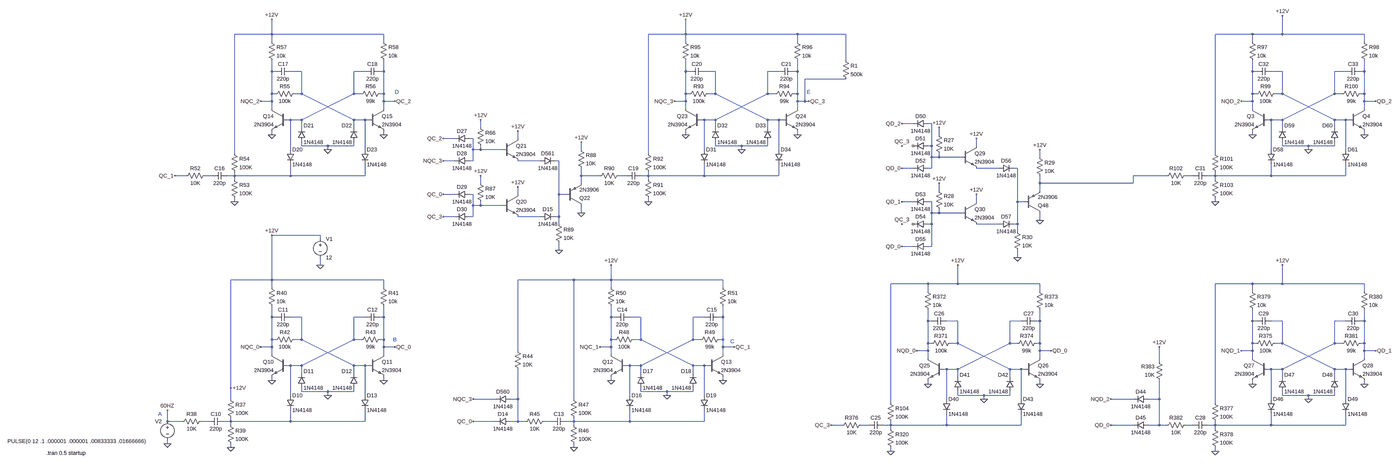
[diagram p0: schematic clock-scaler.asc, whole sheet]
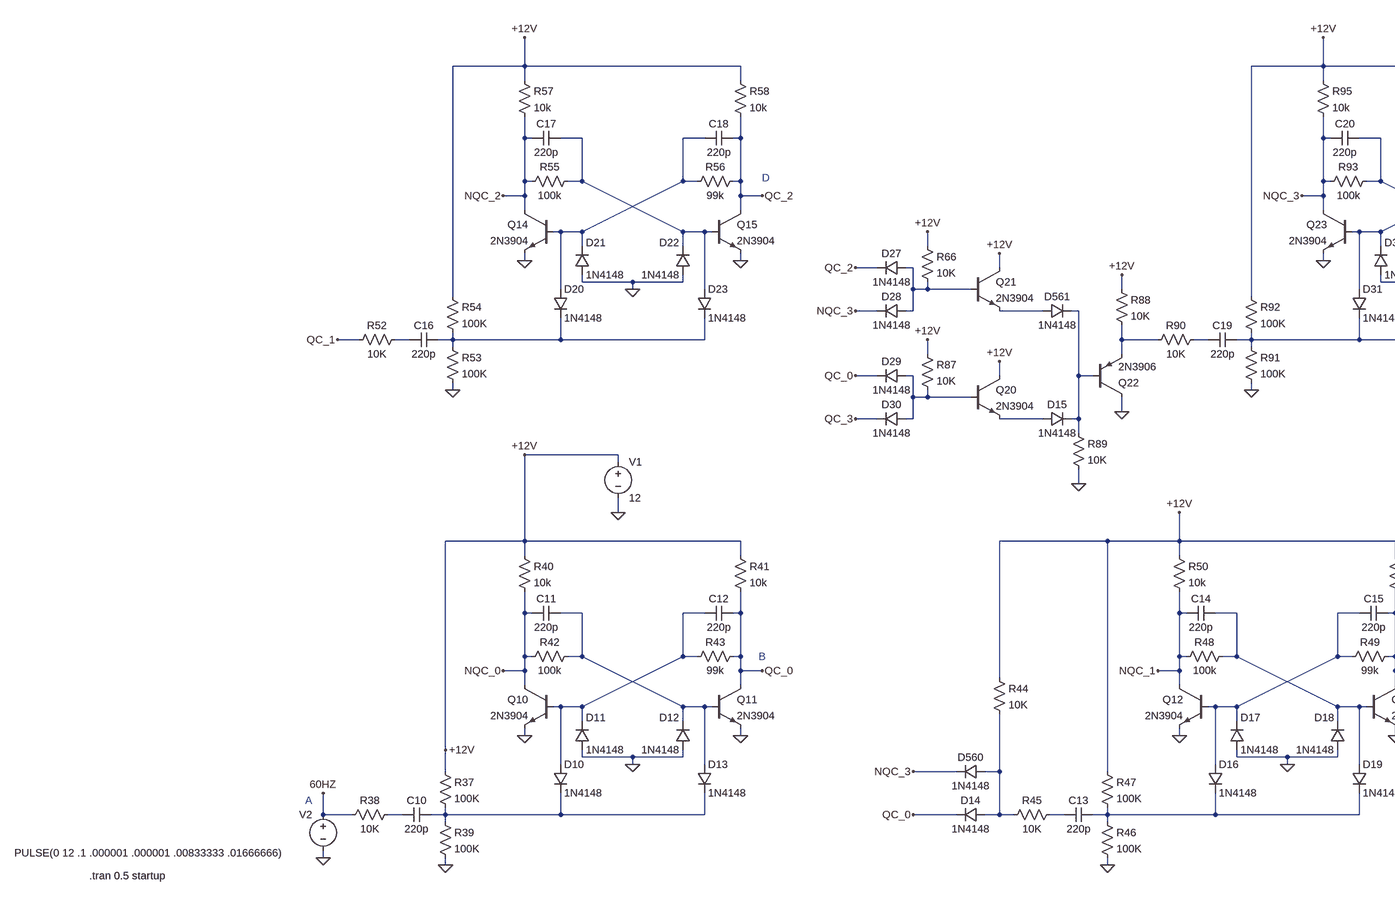
[diagram p1: schematic clock-scaler.asc, part, row 1 of 1, column 1 of 2]
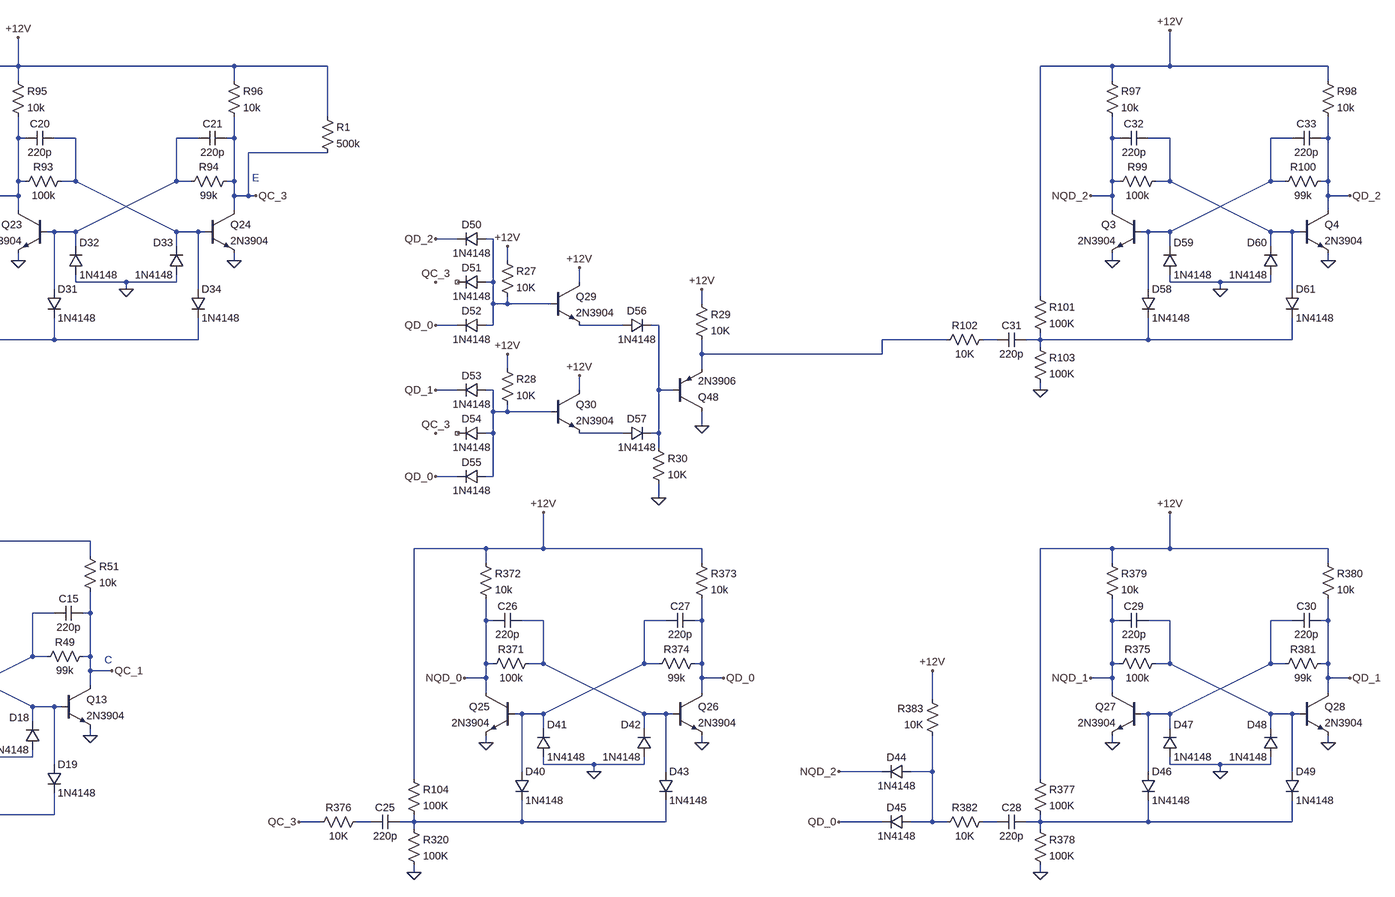
[diagram p2: schematic clock-scaler.asc, part, row 1 of 1, column 2 of 2]
clock-scaler.asc, the LTspice schematic file:
Version 4
SHEET 1 5132 680
WIRE 112 -1232 112 -1296
WIRE 112 -1232 -48 -1232
WIRE 592 -1232 112 -1232
WIRE 1888 -1232 1888 -1296
WIRE 1888 -1232 1728 -1232
WIRE 2368 -1232 1888 -1232
WIRE 2576 -1232 2368 -1232
WIRE 4416 -1232 4256 -1232
WIRE 4544 -1232 4544 -1312
WIRE 4544 -1232 4416 -1232
WIRE 4896 -1232 4544 -1232
WIRE 112 -1200 112 -1232
WIRE 592 -1200 592 -1232
WIRE 1888 -1200 1888 -1232
WIRE 2368 -1200 2368 -1232
WIRE 4416 -1200 4416 -1232
WIRE 4896 -1200 4896 -1232
WIRE 2576 -1120 2576 -1232
WIRE 112 -1072 112 -1120
WIRE 128 -1072 112 -1072
WIRE 240 -1072 192 -1072
WIRE 512 -1072 464 -1072
WIRE 592 -1072 592 -1120
WIRE 592 -1072 576 -1072
WIRE 1888 -1072 1888 -1120
WIRE 1904 -1072 1888 -1072
WIRE 2016 -1072 1968 -1072
WIRE 2288 -1072 2240 -1072
WIRE 2368 -1072 2368 -1120
WIRE 2368 -1072 2352 -1072
WIRE 4416 -1072 4416 -1120
WIRE 4432 -1072 4416 -1072
WIRE 4544 -1072 4496 -1072
WIRE 4816 -1072 4768 -1072
WIRE 4896 -1072 4896 -1120
WIRE 4896 -1072 4880 -1072
WIRE 2576 -1040 2400 -1040
WIRE 112 -976 112 -1072
WIRE 128 -976 112 -976
WIRE 240 -976 240 -1072
WIRE 240 -976 208 -976
WIRE 464 -976 464 -1072
WIRE 496 -976 464 -976
WIRE 592 -976 592 -1072
WIRE 592 -976 576 -976
WIRE 1888 -976 1888 -1072
WIRE 1904 -976 1888 -976
WIRE 2016 -976 2016 -1072
WIRE 2016 -976 1984 -976
WIRE 2240 -976 2240 -1072
WIRE 2272 -976 2240 -976
WIRE 2368 -976 2368 -1072
WIRE 2368 -976 2352 -976
WIRE 4416 -976 4416 -1072
WIRE 4432 -976 4416 -976
WIRE 4544 -976 4544 -1072
WIRE 4544 -976 4512 -976
WIRE 4768 -976 4768 -1072
WIRE 4800 -976 4768 -976
WIRE 4896 -976 4896 -1072
WIRE 4896 -976 4880 -976
WIRE 112 -944 112 -976
WIRE 112 -944 64 -944
WIRE 592 -944 592 -976
WIRE 640 -944 592 -944
WIRE 1888 -944 1888 -976
WIRE 1888 -944 1840 -944
WIRE 2368 -944 2368 -976
WIRE 2400 -944 2400 -1040
WIRE 2400 -944 2368 -944
WIRE 2416 -944 2400 -944
WIRE 4416 -944 4416 -976
WIRE 4416 -944 4368 -944
WIRE 4896 -944 4896 -976
WIRE 4944 -944 4896 -944
WIRE 112 -912 112 -944
WIRE 592 -912 592 -944
WIRE 1888 -912 1888 -944
WIRE 2368 -912 2368 -944
WIRE 4416 -912 4416 -944
WIRE 4896 -912 4896 -944
WIRE 192 -864 176 -864
WIRE 240 -864 464 -976
WIRE 240 -864 192 -864
WIRE 464 -864 240 -976
WIRE 512 -864 464 -864
WIRE 528 -864 512 -864
WIRE 1968 -864 1952 -864
WIRE 2016 -864 2240 -976
WIRE 2016 -864 1968 -864
WIRE 2240 -864 2016 -976
WIRE 2288 -864 2240 -864
WIRE 2304 -864 2288 -864
WIRE 4496 -864 4480 -864
WIRE 4544 -864 4768 -976
WIRE 4544 -864 4496 -864
WIRE 4768 -864 4544 -976
WIRE 4816 -864 4768 -864
WIRE 4832 -864 4816 -864
WIRE 2864 -848 2816 -848
WIRE 2944 -848 2928 -848
WIRE 240 -832 240 -864
WIRE 464 -832 464 -864
WIRE 1008 -832 1008 -864
WIRE 2016 -832 2016 -864
WIRE 2240 -832 2240 -864
WIRE 4544 -832 4544 -864
WIRE 4768 -832 4768 -864
WIRE 112 -800 112 -816
WIRE 592 -800 592 -816
WIRE 1888 -800 1888 -816
WIRE 2368 -800 2368 -816
WIRE 2976 -800 2976 -832
WIRE 4416 -800 4416 -816
WIRE 4896 -800 4896 -816
WIRE 896 -784 848 -784
WIRE 976 -784 960 -784
WIRE 1168 -784 1168 -816
WIRE 240 -752 240 -768
WIRE 352 -752 240 -752
WIRE 464 -752 464 -768
WIRE 464 -752 352 -752
WIRE 2016 -752 2016 -768
WIRE 2128 -752 2016 -752
WIRE 2240 -752 2240 -768
WIRE 2240 -752 2128 -752
WIRE 2944 -752 2944 -848
WIRE 2944 -752 2928 -752
WIRE 3136 -752 3136 -784
WIRE 4544 -752 4544 -768
WIRE 4656 -752 4544 -752
WIRE 4768 -752 4768 -768
WIRE 4768 -752 4656 -752
WIRE 192 -736 192 -864
WIRE 352 -736 352 -752
WIRE 512 -736 512 -864
WIRE 976 -736 976 -784
WIRE 1008 -736 1008 -752
WIRE 1008 -736 976 -736
WIRE 1104 -736 1008 -736
WIRE 1440 -736 1440 -768
WIRE 1968 -736 1968 -864
WIRE 2128 -736 2128 -752
WIRE 2288 -736 2288 -864
WIRE 4496 -736 4496 -864
WIRE 4656 -736 4656 -752
WIRE 4816 -736 4816 -864
WIRE -48 -720 -48 -1232
WIRE 1728 -720 1728 -1232
WIRE 4256 -720 4256 -1232
WIRE 2944 -704 2944 -752
WIRE 2976 -704 2976 -720
WIRE 2976 -704 2944 -704
WIRE 3072 -704 2976 -704
WIRE 3408 -704 3408 -736
WIRE 896 -688 848 -688
WIRE 976 -688 976 -736
WIRE 976 -688 960 -688
WIRE 1264 -688 1168 -688
WIRE 1344 -688 1328 -688
WIRE 2864 -656 2816 -656
WIRE 2944 -656 2944 -704
WIRE 2944 -656 2928 -656
WIRE 3232 -656 3136 -656
WIRE 3312 -656 3296 -656
WIRE -256 -624 -304 -624
WIRE -144 -624 -176 -624
WIRE -48 -624 -48 -640
WIRE -48 -624 -80 -624
WIRE 192 -624 192 -672
WIRE 192 -624 -48 -624
WIRE 512 -624 512 -672
WIRE 512 -624 192 -624
WIRE 1440 -624 1440 -656
WIRE 1520 -624 1440 -624
WIRE 1632 -624 1600 -624
WIRE 1728 -624 1728 -640
WIRE 1728 -624 1696 -624
WIRE 1968 -624 1968 -672
WIRE 1968 -624 1728 -624
WIRE 2288 -624 2288 -672
WIRE 2288 -624 1968 -624
WIRE 4048 -624 3904 -624
WIRE 4160 -624 4128 -624
WIRE 4256 -624 4256 -640
WIRE 4256 -624 4224 -624
WIRE 4496 -624 4496 -672
WIRE 4496 -624 4256 -624
WIRE 4816 -624 4816 -672
WIRE 4816 -624 4496 -624
WIRE -48 -608 -48 -624
WIRE 1728 -608 1728 -624
WIRE 4256 -608 4256 -624
WIRE 1008 -592 1008 -624
WIRE 1440 -592 1440 -624
WIRE 3408 -592 3408 -624
WIRE 3904 -592 3904 -624
WIRE 3904 -592 3408 -592
WIRE 2976 -560 2976 -592
WIRE 3408 -560 3408 -592
WIRE 896 -544 848 -544
WIRE 976 -544 960 -544
WIRE 1168 -544 1168 -576
WIRE 1344 -544 1344 -688
WIRE 1376 -544 1344 -544
WIRE -48 -512 -48 -528
WIRE 1728 -512 1728 -528
WIRE 2864 -512 2816 -512
WIRE 2944 -512 2928 -512
WIRE 3136 -512 3136 -544
WIRE 3312 -512 3312 -656
WIRE 3344 -512 3312 -512
WIRE 4256 -512 4256 -528
WIRE 976 -496 976 -544
WIRE 1008 -496 1008 -512
WIRE 1008 -496 976 -496
WIRE 1104 -496 1008 -496
WIRE 1440 -464 1440 -496
WIRE 2944 -464 2944 -512
WIRE 2976 -464 2976 -480
WIRE 2976 -464 2944 -464
WIRE 3072 -464 2976 -464
WIRE 896 -448 848 -448
WIRE 976 -448 976 -496
WIRE 976 -448 960 -448
WIRE 1264 -448 1168 -448
WIRE 1344 -448 1344 -544
WIRE 1344 -448 1328 -448
WIRE 3408 -432 3408 -464
WIRE 1344 -416 1344 -448
WIRE 2944 -416 2944 -464
WIRE 2944 -416 2928 -416
WIRE 3232 -416 3136 -416
WIRE 3312 -416 3312 -512
WIRE 3312 -416 3296 -416
WIRE 3312 -384 3312 -416
WIRE 320 -368 112 -368
WIRE 320 -352 320 -368
WIRE 2864 -320 2816 -320
WIRE 2944 -320 2944 -416
WIRE 2944 -320 2928 -320
WIRE 1344 -304 1344 -336
WIRE 3312 -272 3312 -304
WIRE 320 -240 320 -272
WIRE 112 -176 112 -368
WIRE 112 -176 -64 -176
WIRE 592 -176 112 -176
WIRE 1408 -176 1168 -176
WIRE 1568 -176 1568 -240
WIRE 1568 -176 1408 -176
WIRE 2048 -176 1568 -176
WIRE 2928 -160 2768 -160
WIRE 3056 -160 3056 -240
WIRE 3056 -160 2928 -160
WIRE 3408 -160 3056 -160
WIRE 4416 -160 4256 -160
WIRE 4544 -160 4544 -240
WIRE 4544 -160 4416 -160
WIRE 4896 -160 4544 -160
WIRE 112 -144 112 -176
WIRE 592 -144 592 -176
WIRE 1568 -144 1568 -176
WIRE 2048 -144 2048 -176
WIRE 2928 -128 2928 -160
WIRE 3408 -128 3408 -160
WIRE 4416 -128 4416 -160
WIRE 4896 -128 4896 -160
WIRE 112 -16 112 -64
WIRE 128 -16 112 -16
WIRE 240 -16 192 -16
WIRE 512 -16 464 -16
WIRE 592 -16 592 -64
WIRE 592 -16 576 -16
WIRE 1568 -16 1568 -64
WIRE 1584 -16 1568 -16
WIRE 1696 -16 1648 -16
WIRE 1968 -16 1920 -16
WIRE 2048 -16 2048 -64
WIRE 2048 -16 2032 -16
WIRE 2928 0 2928 -48
WIRE 2944 0 2928 0
WIRE 3056 0 3008 0
WIRE 3328 0 3280 0
WIRE 3408 0 3408 -48
WIRE 3408 0 3392 0
WIRE 4416 0 4416 -48
WIRE 4432 0 4416 0
WIRE 4544 0 4496 0
WIRE 4816 0 4768 0
WIRE 4896 0 4896 -48
WIRE 4896 0 4880 0
WIRE 112 80 112 -16
WIRE 128 80 112 80
WIRE 240 80 240 -16
WIRE 240 80 208 80
WIRE 464 80 464 -16
WIRE 496 80 464 80
WIRE 592 80 592 -16
WIRE 592 80 576 80
WIRE 1568 80 1568 -16
WIRE 1584 80 1568 80
WIRE 1696 80 1696 -16
WIRE 1696 80 1664 80
WIRE 1920 80 1920 -16
WIRE 1952 80 1920 80
WIRE 2048 80 2048 -16
WIRE 2048 80 2032 80
WIRE 2928 96 2928 0
WIRE 2944 96 2928 96
WIRE 3056 96 3056 0
WIRE 3056 96 3024 96
WIRE 3280 96 3280 0
WIRE 3312 96 3280 96
WIRE 3408 96 3408 0
WIRE 3408 96 3392 96
WIRE 4416 96 4416 0
WIRE 4432 96 4416 96
WIRE 4544 96 4544 0
WIRE 4544 96 4512 96
WIRE 4768 96 4768 0
WIRE 4800 96 4768 96
WIRE 4896 96 4896 0
WIRE 4896 96 4880 96
WIRE 112 112 112 80
WIRE 112 112 64 112
WIRE 592 112 592 80
WIRE 640 112 592 112
WIRE 1568 112 1568 80
WIRE 1568 112 1520 112
WIRE 2048 112 2048 80
WIRE 2096 112 2048 112
WIRE 1168 128 1168 -176
WIRE 2928 128 2928 96
WIRE 2928 128 2880 128
WIRE 3408 128 3408 96
WIRE 3456 128 3408 128
WIRE 4416 128 4416 96
WIRE 4416 128 4368 128
WIRE 4896 128 4896 96
WIRE 4944 128 4896 128
WIRE 112 144 112 112
WIRE 592 144 592 112
WIRE 1568 144 1568 112
WIRE 2048 144 2048 112
WIRE 2928 160 2928 128
WIRE 3408 160 3408 128
WIRE 4416 160 4416 128
WIRE 4896 160 4896 128
WIRE 4016 176 4016 112
WIRE 192 192 176 192
WIRE 240 192 464 80
WIRE 240 192 192 192
WIRE 464 192 240 80
WIRE 512 192 464 192
WIRE 528 192 512 192
WIRE 1648 192 1632 192
WIRE 1696 192 1920 80
WIRE 1696 192 1648 192
WIRE 1920 192 1696 80
WIRE 1968 192 1920 192
WIRE 1984 192 1968 192
WIRE 3008 208 2992 208
WIRE 3056 208 3280 96
WIRE 3056 208 3008 208
WIRE 3280 208 3056 96
WIRE 3328 208 3280 208
WIRE 3344 208 3328 208
WIRE 4496 208 4480 208
WIRE 4544 208 4768 96
WIRE 4544 208 4496 208
WIRE 4768 208 4544 96
WIRE 4816 208 4768 208
WIRE 4832 208 4816 208
WIRE 240 224 240 192
WIRE 464 224 464 192
WIRE 1696 224 1696 192
WIRE 1920 224 1920 192
WIRE 3056 240 3056 208
WIRE 3280 240 3280 208
WIRE 4544 240 4544 208
WIRE 4768 240 4768 208
WIRE 112 256 112 240
WIRE 592 256 592 240
WIRE 1568 256 1568 240
WIRE 2048 256 2048 240
WIRE 2928 272 2928 256
WIRE 3408 272 3408 256
WIRE 4416 272 4416 256
WIRE 4896 272 4896 256
WIRE -64 288 -64 -176
WIRE 240 304 240 288
WIRE 352 304 240 304
WIRE 464 304 464 288
WIRE 464 304 352 304
WIRE 1696 304 1696 288
WIRE 1808 304 1696 304
WIRE 1920 304 1920 288
WIRE 1920 304 1808 304
WIRE 192 320 192 192
WIRE 352 320 352 304
WIRE 512 320 512 192
WIRE 1648 320 1648 192
WIRE 1808 320 1808 304
WIRE 1968 320 1968 192
WIRE 3056 320 3056 304
WIRE 3168 320 3056 320
WIRE 3280 320 3280 304
WIRE 3280 320 3168 320
WIRE 4544 320 4544 304
WIRE 4656 320 4544 320
WIRE 4768 320 4768 304
WIRE 4768 320 4656 320
WIRE -64 336 -64 288
WIRE 1072 336 976 336
WIRE 1168 336 1168 208
WIRE 1168 336 1136 336
WIRE 1408 336 1408 -176
WIRE 3008 336 3008 208
WIRE 3168 336 3168 320
WIRE 3328 336 3328 208
WIRE 3904 336 3808 336
WIRE 4016 336 4016 256
WIRE 4016 336 3968 336
WIRE 4496 336 4496 208
WIRE 4656 336 4656 320
WIRE 4816 336 4816 208
WIRE 2768 352 2768 -160
WIRE 4256 352 4256 -160
WIRE -336 432 -336 384
WIRE -272 432 -336 432
WIRE -160 432 -192 432
WIRE -64 432 -64 416
WIRE -64 432 -96 432
WIRE 192 432 192 384
WIRE 192 432 -64 432
WIRE 512 432 512 384
WIRE 512 432 192 432
WIRE 1072 432 976 432
WIRE 1168 432 1168 336
WIRE 1168 432 1136 432
WIRE 1200 432 1168 432
WIRE 1312 432 1280 432
WIRE 1408 432 1408 416
WIRE 1408 432 1376 432
WIRE 1648 432 1648 384
WIRE 1648 432 1408 432
WIRE 1968 432 1968 384
WIRE 1968 432 1648 432
WIRE -64 448 -64 432
WIRE 1408 448 1408 432
WIRE 2560 448 2512 448
WIRE 2672 448 2640 448
WIRE 2768 448 2768 432
WIRE 2768 448 2736 448
WIRE 3008 448 3008 400
WIRE 3008 448 2768 448
WIRE 3328 448 3328 400
WIRE 3328 448 3008 448
WIRE 3904 448 3808 448
WIRE 4016 448 4016 336
WIRE 4016 448 3968 448
WIRE 4048 448 4016 448
WIRE 4160 448 4128 448
WIRE 4256 448 4256 432
WIRE 4256 448 4224 448
WIRE 4496 448 4496 400
WIRE 4496 448 4256 448
WIRE 4816 448 4816 400
WIRE 4816 448 4496 448
WIRE 2768 464 2768 448
WIRE 4256 464 4256 448
WIRE -336 528 -336 512
WIRE -64 544 -64 528
WIRE 1408 544 1408 528
WIRE 2768 560 2768 544
WIRE 4256 560 4256 544
FLAG 112 256 0
FLAG 592 256 0
FLAG 352 320 0
FLAG 320 -240 0
FLAG -64 544 0
FLAG -336 528 0
FLAG -336 384 60HZ
FLAG 64 112 NQC_0
FLAG 640 112 QC_0
FLAG 1568 256 0
FLAG 2048 256 0
FLAG 1808 320 0
FLAG 1408 544 0
FLAG 1520 112 NQC_1
FLAG 2096 112 QC_1
FLAG 976 432 QC_0
FLAG 112 -368 +12V
FLAG 1568 -240 +12V
FLAG 112 -800 0
FLAG 592 -800 0
FLAG 352 -736 0
FLAG -48 -512 0
FLAG 64 -944 NQC_2
FLAG 640 -944 QC_2
FLAG 112 -1296 +12V
FLAG -304 -624 QC_1
FLAG 1888 -800 0
FLAG 2368 -800 0
FLAG 2128 -736 0
FLAG 1728 -512 0
FLAG 1840 -944 NQC_3
FLAG 2416 -944 QC_3
FLAG 1888 -1296 +12V
FLAG 1440 -464 0
FLAG 1168 -576 +12V
FLAG 1168 -816 +12V
FLAG 1008 -864 +12V
FLAG 1008 -624 +12V
FLAG 1344 -304 0
FLAG 848 -784 QC_2
FLAG 848 -688 NQC_3
FLAG 848 -544 QC_0
FLAG 848 -448 QC_3
FLAG 1440 -768 +12V
FLAG 976 336 NQC_3
FLAG 2928 272 0
FLAG 3408 272 0
FLAG 3168 336 0
FLAG 2768 560 0
FLAG 2880 128 NQD_0
FLAG 3456 128 QD_0
FLAG 2512 448 QC_3
FLAG 3408 -432 0
FLAG 3136 -544 +12V
FLAG 3136 -784 +12V
FLAG 2976 -832 +12V
FLAG 2976 -592 +12V
FLAG 3312 -272 0
FLAG 2816 -752 QC_3
FLAG 2816 -416 QC_3
FLAG 3408 -736 +12V
FLAG 3056 -240 +12V
FLAG 2816 -320 QD_0
FLAG 2816 -656 QD_0
FLAG 4416 272 0
FLAG 4896 272 0
FLAG 4656 336 0
FLAG 4256 560 0
FLAG 4368 128 NQD_1
FLAG 4944 128 QD_1
FLAG 4544 -240 +12V
FLAG 4416 -800 0
FLAG 4896 -800 0
FLAG 4656 -736 0
FLAG 4256 -512 0
FLAG 4368 -944 NQD_2
FLAG 4944 -944 QD_2
FLAG 4544 -1312 +12V
FLAG 2816 -512 QD_1
FLAG 2816 -848 QD_2
FLAG 3808 336 NQD_2
FLAG 3808 448 QD_0
FLAG 4016 112 +12V
FLAG -64 288 +12V
SYMBOL npn 176 144 M0
SYMATTR InstName Q10
SYMATTR Value 2N3904
SYMBOL npn 528 144 R0
SYMATTR InstName Q11
SYMATTR Value 2N3904
SYMBOL diode 176 320 R0
SYMATTR InstName D10
SYMATTR Value 1N4148
SYMBOL diode 496 320 R0
SYMATTR InstName D13
SYMATTR Value 1N4148
SYMBOL diode 224 288 M180
WINDOW 0 24 72 Left 2
WINDOW 3 24 0 Left 2
SYMATTR InstName D11
SYMATTR Value 1N4148
SYMBOL diode 480 288 R180
WINDOW 0 24 72 Left 2
WINDOW 3 24 0 Left 2
SYMATTR InstName D12
SYMATTR Value 1N4148
SYMBOL res 224 64 R90
WINDOW 0 0 56 VBottom 2
WINDOW 3 32 56 VTop 2
SYMATTR InstName R42
SYMATTR Value 100k
SYMBOL res 592 64 R90
WINDOW 0 0 56 VBottom 2
WINDOW 3 32 56 VTop 2
SYMATTR InstName R43
SYMATTR Value 99k
SYMBOL cap 128 -32 M90
WINDOW 0 0 32 VBottom 2
WINDOW 3 32 32 VTop 2
SYMATTR InstName C11
SYMATTR Value 220p
SYMBOL cap 576 -32 R90
WINDOW 0 0 32 VBottom 2
WINDOW 3 32 32 VTop 2
SYMATTR InstName C12
SYMATTR Value 220p
SYMBOL res 96 -160 R0
SYMATTR InstName R40
SYMATTR Value 10k
SYMBOL res 576 -160 R0
SYMATTR InstName R41
SYMATTR Value 10k
SYMBOL res -80 320 R0
SYMATTR InstName R37
SYMATTR Value 100K
SYMBOL voltage 320 -368 R0
WINDOW 123 0 0 Left 2
WINDOW 39 0 0 Left 2
SYMATTR InstName V1
SYMATTR Value 12
SYMBOL res -80 432 R0
SYMATTR InstName R39
SYMATTR Value 100K
SYMBOL cap -96 416 R90
WINDOW 0 0 32 VBottom 2
WINDOW 3 32 32 VTop 2
SYMATTR InstName C10
SYMATTR Value 220p
SYMBOL res -176 416 R90
WINDOW 0 0 56 VBottom 2
WINDOW 3 32 56 VTop 2
SYMATTR InstName R38
SYMATTR Value 10K
SYMBOL voltage -336 416 M0
WINDOW 3 86 101 Left 2
WINDOW 123 0 0 Left 2
WINDOW 39 0 0 Left 2
SYMATTR Value PULSE(0 12 .1 .000001 .000001 .00833333 .01666666)
SYMATTR InstName V2
SYMBOL npn 1632 144 M0
SYMATTR InstName Q12
SYMATTR Value 2N3904
SYMBOL npn 1984 144 R0
SYMATTR InstName Q13
SYMATTR Value 2N3904
SYMBOL diode 1632 320 R0
SYMATTR InstName D16
SYMATTR Value 1N4148
SYMBOL diode 1952 320 R0
SYMATTR InstName D19
SYMATTR Value 1N4148
SYMBOL diode 1680 288 M180
WINDOW 0 24 72 Left 2
WINDOW 3 24 0 Left 2
SYMATTR InstName D17
SYMATTR Value 1N4148
SYMBOL diode 1936 288 R180
WINDOW 0 24 72 Left 2
WINDOW 3 24 0 Left 2
SYMATTR InstName D18
SYMATTR Value 1N4148
SYMBOL res 1680 64 R90
WINDOW 0 0 56 VBottom 2
WINDOW 3 32 56 VTop 2
SYMATTR InstName R48
SYMATTR Value 100k
SYMBOL res 2048 64 R90
WINDOW 0 0 56 VBottom 2
WINDOW 3 32 56 VTop 2
SYMATTR InstName R49
SYMATTR Value 99k
SYMBOL cap 1648 -32 R90
WINDOW 0 0 32 VBottom 2
WINDOW 3 32 32 VTop 2
SYMATTR InstName C14
SYMATTR Value 220p
SYMBOL cap 2032 -32 R90
WINDOW 0 0 32 VBottom 2
WINDOW 3 32 32 VTop 2
SYMATTR InstName C15
SYMATTR Value 220p
SYMBOL res 1552 -160 R0
SYMATTR InstName R50
SYMATTR Value 10k
SYMBOL res 2032 -160 R0
SYMATTR InstName R51
SYMATTR Value 10k
SYMBOL res 1392 320 R0
SYMATTR InstName R47
SYMATTR Value 100K
SYMBOL res 1392 432 R0
SYMATTR InstName R46
SYMATTR Value 100K
SYMBOL cap 1376 416 R90
WINDOW 0 0 32 VBottom 2
WINDOW 3 32 32 VTop 2
SYMATTR InstName C13
SYMATTR Value 220p
SYMBOL res 1296 416 R90
WINDOW 0 0 56 VBottom 2
WINDOW 3 32 56 VTop 2
SYMATTR InstName R45
SYMATTR Value 10K
SYMBOL diode 1136 416 R90
WINDOW 0 0 32 VBottom 2
WINDOW 3 32 32 VTop 2
SYMATTR InstName D14
SYMATTR Value 1N4148
SYMBOL res 1152 112 R0
SYMATTR InstName R44
SYMATTR Value 10K
SYMBOL npn 176 -912 M0
SYMATTR InstName Q14
SYMATTR Value 2N3904
SYMBOL npn 528 -912 R0
SYMATTR InstName Q15
SYMATTR Value 2N3904
SYMBOL diode 176 -736 R0
SYMATTR InstName D20
SYMATTR Value 1N4148
SYMBOL diode 496 -736 R0
SYMATTR InstName D23
SYMATTR Value 1N4148
SYMBOL diode 224 -768 M180
WINDOW 0 24 72 Left 2
WINDOW 3 24 0 Left 2
SYMATTR InstName D21
SYMATTR Value 1N4148
SYMBOL diode 480 -768 R180
WINDOW 0 24 72 Left 2
WINDOW 3 24 0 Left 2
SYMATTR InstName D22
SYMATTR Value 1N4148
SYMBOL res 224 -992 R90
WINDOW 0 0 56 VBottom 2
WINDOW 3 32 56 VTop 2
SYMATTR InstName R55
SYMATTR Value 100k
SYMBOL res 592 -992 R90
WINDOW 0 0 56 VBottom 2
WINDOW 3 32 56 VTop 2
SYMATTR InstName R56
SYMATTR Value 99k
SYMBOL cap 192 -1088 R90
WINDOW 0 0 32 VBottom 2
WINDOW 3 32 32 VTop 2
SYMATTR InstName C17
SYMATTR Value 220p
SYMBOL cap 576 -1088 R90
WINDOW 0 0 32 VBottom 2
WINDOW 3 32 32 VTop 2
SYMATTR InstName C18
SYMATTR Value 220p
SYMBOL res 96 -1216 R0
SYMATTR InstName R57
SYMATTR Value 10k
SYMBOL res 576 -1216 R0
SYMATTR InstName R58
SYMATTR Value 10k
SYMBOL res -64 -736 R0
SYMATTR InstName R54
SYMATTR Value 100K
SYMBOL res -64 -624 R0
SYMATTR InstName R53
SYMATTR Value 100K
SYMBOL cap -80 -640 R90
WINDOW 0 0 32 VBottom 2
WINDOW 3 32 32 VTop 2
SYMATTR InstName C16
SYMATTR Value 220p
SYMBOL res -160 -640 R90
WINDOW 0 0 56 VBottom 2
WINDOW 3 32 56 VTop 2
SYMATTR InstName R52
SYMATTR Value 10K
SYMBOL npn 1952 -912 M0
SYMATTR InstName Q23
SYMATTR Value 2N3904
SYMBOL npn 2304 -912 R0
SYMATTR InstName Q24
SYMATTR Value 2N3904
SYMBOL diode 1952 -736 R0
SYMATTR InstName D31
SYMATTR Value 1N4148
SYMBOL diode 2272 -736 R0
SYMATTR InstName D34
SYMATTR Value 1N4148
SYMBOL diode 2000 -768 M180
WINDOW 0 24 72 Left 2
WINDOW 3 24 0 Left 2
SYMATTR InstName D32
SYMATTR Value 1N4148
SYMBOL diode 2256 -768 R180
WINDOW 0 24 72 Left 2
WINDOW 3 24 0 Left 2
SYMATTR InstName D33
SYMATTR Value 1N4148
SYMBOL res 2000 -992 R90
WINDOW 0 0 56 VBottom 2
WINDOW 3 32 56 VTop 2
SYMATTR InstName R93
SYMATTR Value 100k
SYMBOL res 2368 -992 R90
WINDOW 0 0 56 VBottom 2
WINDOW 3 32 56 VTop 2
SYMATTR InstName R94
SYMATTR Value 99k
SYMBOL cap 1968 -1088 R90
WINDOW 0 0 32 VBottom 2
WINDOW 3 32 32 VTop 2
SYMATTR InstName C20
SYMATTR Value 220p
SYMBOL cap 2352 -1088 R90
WINDOW 0 0 32 VBottom 2
WINDOW 3 32 32 VTop 2
SYMATTR InstName C21
SYMATTR Value 220p
SYMBOL res 1872 -1216 R0
SYMATTR InstName R95
SYMATTR Value 10k
SYMBOL res 2352 -1216 R0
SYMATTR InstName R96
SYMATTR Value 10k
SYMBOL res 1712 -736 R0
SYMATTR InstName R92
SYMATTR Value 100K
SYMBOL res 1712 -624 R0
SYMATTR InstName R91
SYMATTR Value 100K
SYMBOL cap 1696 -640 R90
WINDOW 0 0 32 VBottom 2
WINDOW 3 32 32 VTop 2
SYMATTR InstName C19
SYMATTR Value 220p
SYMBOL res 1616 -640 R90
WINDOW 0 0 56 VBottom 2
WINDOW 3 32 56 VTop 2
SYMATTR InstName R90
SYMATTR Value 10K
SYMBOL pnp 1376 -496 M180
SYMATTR InstName Q22
SYMATTR Value 2N3906
SYMBOL res 1424 -752 R0
SYMATTR InstName R88
SYMATTR Value 10K
SYMBOL diode 1264 -464 M90
WINDOW 0 0 32 VBottom 2
WINDOW 3 32 32 VTop 2
SYMATTR InstName D15
SYMATTR Value 1N4148
SYMBOL diode 1264 -704 M90
WINDOW 0 0 32 VBottom 2
WINDOW 3 32 32 VTop 2
SYMATTR InstName D561
SYMATTR Value 1N4148
SYMBOL npn 1104 -544 R0
SYMATTR InstName Q20
SYMATTR Value 2N3904
SYMBOL npn 1104 -784 R0
SYMATTR InstName Q21
SYMATTR Value 2N3904
SYMBOL res 992 -608 R0
SYMATTR InstName R87
SYMATTR Value 10K
SYMBOL res 992 -848 R0
SYMATTR InstName R66
SYMATTR Value 10K
SYMBOL diode 960 -800 R90
WINDOW 0 0 32 VBottom 2
WINDOW 3 32 32 VTop 2
SYMATTR InstName D27
SYMATTR Value 1N4148
SYMBOL diode 960 -704 R90
WINDOW 0 0 32 VBottom 2
WINDOW 3 32 32 VTop 2
SYMATTR InstName D28
SYMATTR Value 1N4148
SYMBOL diode 960 -560 R90
WINDOW 0 0 32 VBottom 2
WINDOW 3 32 32 VTop 2
SYMATTR InstName D29
SYMATTR Value 1N4148
SYMBOL diode 960 -464 R90
WINDOW 0 0 32 VBottom 2
WINDOW 3 32 32 VTop 2
SYMATTR InstName D30
SYMATTR Value 1N4148
SYMBOL res 1328 -432 R0
SYMATTR InstName R89
SYMATTR Value 10K
SYMBOL diode 1136 320 R90
WINDOW 0 0 32 VBottom 2
WINDOW 3 32 32 VTop 2
SYMATTR InstName D560
SYMATTR Value 1N4148
SYMBOL npn 2992 160 M0
SYMATTR InstName Q25
SYMATTR Value 2N3904
SYMBOL npn 3344 160 R0
SYMATTR InstName Q26
SYMATTR Value 2N3904
SYMBOL diode 2992 336 R0
SYMATTR InstName D40
SYMATTR Value 1N4148
SYMBOL diode 3312 336 R0
SYMATTR InstName D43
SYMATTR Value 1N4148
SYMBOL diode 3040 304 M180
WINDOW 0 24 72 Left 2
WINDOW 3 24 0 Left 2
SYMATTR InstName D41
SYMATTR Value 1N4148
SYMBOL diode 3296 304 R180
WINDOW 0 24 72 Left 2
WINDOW 3 24 0 Left 2
SYMATTR InstName D42
SYMATTR Value 1N4148
SYMBOL res 3040 80 R90
WINDOW 0 0 56 VBottom 2
WINDOW 3 32 56 VTop 2
SYMATTR InstName R371
SYMATTR Value 100k
SYMBOL res 3408 80 R90
WINDOW 0 0 56 VBottom 2
WINDOW 3 32 56 VTop 2
SYMATTR InstName R374
SYMATTR Value 99k
SYMBOL cap 3008 -16 R90
WINDOW 0 0 32 VBottom 2
WINDOW 3 32 32 VTop 2
SYMATTR InstName C26
SYMATTR Value 220p
SYMBOL cap 3392 -16 R90
WINDOW 0 0 32 VBottom 2
WINDOW 3 32 32 VTop 2
SYMATTR InstName C27
SYMATTR Value 220p
SYMBOL res 2912 -144 R0
SYMATTR InstName R372
SYMATTR Value 10k
SYMBOL res 3392 -144 R0
SYMATTR InstName R373
SYMATTR Value 10k
SYMBOL res 2752 336 R0
SYMATTR InstName R104
SYMATTR Value 100K
SYMBOL res 2752 448 R0
SYMATTR InstName R320
SYMATTR Value 100K
SYMBOL cap 2736 432 R90
WINDOW 0 0 32 VBottom 2
WINDOW 3 32 32 VTop 2
SYMATTR InstName C25
SYMATTR Value 220p
SYMBOL res 2656 432 R90
WINDOW 0 0 56 VBottom 2
WINDOW 3 32 56 VTop 2
SYMATTR InstName R376
SYMATTR Value 10K
SYMBOL pnp 3344 -464 M180
SYMATTR InstName Q48
SYMATTR Value 2N3906
SYMBOL res 3392 -720 R0
SYMATTR InstName R29
SYMATTR Value 10K
SYMBOL diode 3232 -432 M90
WINDOW 0 0 32 VBottom 2
WINDOW 3 32 32 VTop 2
SYMATTR InstName D57
SYMATTR Value 1N4148
SYMBOL diode 3232 -672 M90
WINDOW 0 0 32 VBottom 2
WINDOW 3 32 32 VTop 2
SYMATTR InstName D56
SYMATTR Value 1N4148
SYMBOL npn 3072 -512 R0
SYMATTR InstName Q30
SYMATTR Value 2N3904
SYMBOL npn 3072 -752 R0
SYMATTR InstName Q29
SYMATTR Value 2N3904
SYMBOL res 2960 -576 R0
SYMATTR InstName R28
SYMATTR Value 10K
SYMBOL res 2960 -816 R0
SYMATTR InstName R27
SYMATTR Value 10K
SYMBOL diode 2928 -768 R90
WINDOW 0 0 32 VBottom 2
WINDOW 3 32 32 VTop 2
SYMATTR InstName D51
SYMATTR Value 1N4148
SYMBOL diode 2928 -672 R90
WINDOW 0 0 32 VBottom 2
WINDOW 3 32 32 VTop 2
SYMATTR InstName D52
SYMATTR Value 1N4148
SYMBOL diode 2928 -528 R90
WINDOW 0 0 32 VBottom 2
WINDOW 3 32 32 VTop 2
SYMATTR InstName D53
SYMATTR Value 1N4148
SYMBOL diode 2928 -432 R90
WINDOW 0 0 32 VBottom 2
WINDOW 3 32 32 VTop 2
SYMATTR InstName D54
SYMATTR Value 1N4148
SYMBOL res 3296 -400 R0
SYMATTR InstName R30
SYMATTR Value 10K
SYMBOL diode 2928 -864 R90
WINDOW 0 0 32 VBottom 2
WINDOW 3 32 32 VTop 2
SYMATTR InstName D50
SYMATTR Value 1N4148
SYMBOL diode 2928 -336 R90
WINDOW 0 0 32 VBottom 2
WINDOW 3 32 32 VTop 2
SYMATTR InstName D55
SYMATTR Value 1N4148
SYMBOL npn 4480 160 M0
SYMATTR InstName Q27
SYMATTR Value 2N3904
SYMBOL npn 4832 160 R0
SYMATTR InstName Q28
SYMATTR Value 2N3904
SYMBOL diode 4480 336 R0
SYMATTR InstName D46
SYMATTR Value 1N4148
SYMBOL diode 4800 336 R0
SYMATTR InstName D49
SYMATTR Value 1N4148
SYMBOL diode 4528 304 M180
WINDOW 0 24 72 Left 2
WINDOW 3 24 0 Left 2
SYMATTR InstName D47
SYMATTR Value 1N4148
SYMBOL diode 4784 304 R180
WINDOW 0 24 72 Left 2
WINDOW 3 24 0 Left 2
SYMATTR InstName D48
SYMATTR Value 1N4148
SYMBOL res 4528 80 R90
WINDOW 0 0 56 VBottom 2
WINDOW 3 32 56 VTop 2
SYMATTR InstName R375
SYMATTR Value 100k
SYMBOL res 4896 80 R90
WINDOW 0 0 56 VBottom 2
WINDOW 3 32 56 VTop 2
SYMATTR InstName R381
SYMATTR Value 99k
SYMBOL cap 4496 -16 R90
WINDOW 0 0 32 VBottom 2
WINDOW 3 32 32 VTop 2
SYMATTR InstName C29
SYMATTR Value 220p
SYMBOL cap 4880 -16 R90
WINDOW 0 0 32 VBottom 2
WINDOW 3 32 32 VTop 2
SYMATTR InstName C30
SYMATTR Value 220p
SYMBOL res 4400 -144 R0
SYMATTR InstName R379
SYMATTR Value 10k
SYMBOL res 4880 -144 R0
SYMATTR InstName R380
SYMATTR Value 10k
SYMBOL res 4240 336 R0
SYMATTR InstName R377
SYMATTR Value 100K
SYMBOL res 4240 448 R0
SYMATTR InstName R378
SYMATTR Value 100K
SYMBOL cap 4224 432 R90
WINDOW 0 0 32 VBottom 2
WINDOW 3 32 32 VTop 2
SYMATTR InstName C28
SYMATTR Value 220p
SYMBOL res 4144 432 R90
WINDOW 0 0 56 VBottom 2
WINDOW 3 32 56 VTop 2
SYMATTR InstName R382
SYMATTR Value 10K
SYMBOL npn 4480 -912 M0
SYMATTR InstName Q3
SYMATTR Value 2N3904
SYMBOL npn 4832 -912 R0
SYMATTR InstName Q4
SYMATTR Value 2N3904
SYMBOL diode 4480 -736 R0
SYMATTR InstName D58
SYMATTR Value 1N4148
SYMBOL diode 4800 -736 R0
SYMATTR InstName D61
SYMATTR Value 1N4148
SYMBOL diode 4528 -768 M180
WINDOW 0 24 72 Left 2
WINDOW 3 24 0 Left 2
SYMATTR InstName D59
SYMATTR Value 1N4148
SYMBOL diode 4784 -768 R180
WINDOW 0 24 72 Left 2
WINDOW 3 24 0 Left 2
SYMATTR InstName D60
SYMATTR Value 1N4148
SYMBOL res 4528 -992 R90
WINDOW 0 0 56 VBottom 2
WINDOW 3 32 56 VTop 2
SYMATTR InstName R99
SYMATTR Value 100k
SYMBOL res 4896 -992 R90
WINDOW 0 0 56 VBottom 2
WINDOW 3 32 56 VTop 2
SYMATTR InstName R100
SYMATTR Value 99k
SYMBOL cap 4496 -1088 R90
WINDOW 0 0 32 VBottom 2
WINDOW 3 32 32 VTop 2
SYMATTR InstName C32
SYMATTR Value 220p
SYMBOL cap 4880 -1088 R90
WINDOW 0 0 32 VBottom 2
WINDOW 3 32 32 VTop 2
SYMATTR InstName C33
SYMATTR Value 220p
SYMBOL res 4400 -1216 R0
SYMATTR InstName R97
SYMATTR Value 10k
SYMBOL res 4880 -1216 R0
SYMATTR InstName R98
SYMATTR Value 10k
SYMBOL res 4240 -736 R0
SYMATTR InstName R101
SYMATTR Value 100K
SYMBOL res 4240 -624 R0
SYMATTR InstName R103
SYMATTR Value 100K
SYMBOL cap 4224 -640 R90
WINDOW 0 0 32 VBottom 2
WINDOW 3 32 32 VTop 2
SYMATTR InstName C31
SYMATTR Value 220p
SYMBOL res 4144 -640 R90
WINDOW 0 0 56 VBottom 2
WINDOW 3 32 56 VTop 2
SYMATTR InstName R102
SYMATTR Value 10K
SYMBOL diode 3968 432 R90
WINDOW 0 0 32 VBottom 2
WINDOW 3 32 32 VTop 2
SYMATTR InstName D45
SYMATTR Value 1N4148
SYMBOL diode 3968 320 R90
WINDOW 0 0 32 VBottom 2
WINDOW 3 32 32 VTop 2
SYMATTR InstName D44
SYMATTR Value 1N4148
SYMBOL res 4032 272 R180
WINDOW 0 36 76 Left 2
WINDOW 3 36 40 Left 2
SYMATTR InstName R383
SYMATTR Value 10K
SYMBOL res 2560 -1136 R0
SYMATTR InstName R1
SYMATTR Value 500k
TEXT -856 568 Left 2 !.tran 0.5 startup
TEXT -376 400 Left 2 ;A
TEXT 632 80 Left 2 ;B
TEXT 2080 88 Left 2 ;C
TEXT 640 -984 Left 2 ;D
TEXT 2408 -984 Left 2 ;E

The netlist it stands for:
* clock-scaler.asc
Q10 NQC_0 N026 0 0 2N3904
Q11 QC_0 N025 0 0 2N3904
D10 N026 N036 1N4148
D13 N025 N036 1N4148
D11 0 N026 1N4148
D12 0 N025 1N4148
R42 N025 NQC_0 100k
R43 QC_0 N026 99k
C11 NQC_0 N025 220p
C12 QC_0 N026 220p
R40 +12V NQC_0 10k
R41 +12V QC_0 10k
R37 +12V N036 100K
V1 +12V 0 12
R39 N036 0 100K
C10 N036 N035 220p
R38 N035 60HZ 10K
V2 60HZ 0 PULSE(0 12 .1 .000001 .000001 .00833333 .01666666)
Q12 NQC_1 N028 0 0 2N3904
Q13 QC_1 N027 0 0 2N3904
D16 N028 N038 1N4148
D19 N027 N038 1N4148
D17 0 N028 1N4148
D18 0 N027 1N4148
R48 N027 NQC_1 100k
R49 QC_1 N028 99k
C14 N027 NQC_1 220p
C15 QC_1 N028 220p
R50 +12V NQC_1 10k
R51 +12V QC_1 10k
R47 +12V N038 100K
R46 N038 0 100K
C13 N038 N037 220p
R45 N037 N033 10K
D14 N033 QC_0 1N4148
R44 +12V N033 10K
Q14 NQC_2 N002 0 0 2N3904
Q15 QC_2 N001 0 0 2N3904
D20 N002 N014 1N4148
D23 N001 N014 1N4148
D21 0 N002 1N4148
D22 0 N001 1N4148
R55 N001 NQC_2 100k
R56 QC_2 N002 99k
C17 N001 NQC_2 220p
C18 QC_2 N002 220p
R57 +12V NQC_2 10k
R58 +12V QC_2 10k
R54 +12V N014 100K
R53 N014 0 100K
C16 N014 N013 220p
R52 N013 QC_1 10K
Q23 NQC_3 N004 0 0 2N3904
Q24 QC_3 N003 0 0 2N3904
D31 N004 N017 1N4148
D34 N003 N017 1N4148
D32 0 N004 1N4148
D33 0 N003 1N4148
R93 N003 NQC_3 100k
R94 QC_3 N004 99k
C20 N003 NQC_3 220p
C21 QC_3 N004 220p
R95 +12V NQC_3 10k
R96 +12V QC_3 10k
R92 +12V N017 100K
R91 N017 0 100K
C19 N017 N016 220p
R90 N016 N015 10K
Q22 0 N010 N015 0 2N3906
R88 +12V N015 10K
D15 N023 N010 1N4148
D561 N009 N010 1N4148
Q20 +12V N021 N023 0 2N3904
Q21 +12V N008 N009 0 2N3904
R87 +12V N021 10K
R66 +12V N008 10K
D27 N008 QC_2 1N4148
D28 N008 NQC_3 1N4148
D29 N021 QC_0 1N4148
D30 N021 QC_3 1N4148
R89 N010 0 10K
D560 N033 NQC_3 1N4148
Q25 NQD_0 N030 0 0 2N3904
Q26 QD_0 N029 0 0 2N3904
D40 N030 N040 1N4148
D43 N029 N040 1N4148
D41 0 N030 1N4148
D42 0 N029 1N4148
R371 N029 NQD_0 100k
R374 QD_0 N030 99k
C26 N029 NQD_0 220p
C27 QD_0 N030 220p
R372 +12V NQD_0 10k
R373 +12V QD_0 10k
R104 +12V N040 100K
R320 N040 0 100K
C25 N040 N039 220p
R376 N039 QC_3 10K
Q48 0 N012 N018 0 2N3906
R29 +12V N018 10K
D57 N024 N012 1N4148
D56 N011 N012 1N4148
Q30 +12V N022 N024 0 2N3904
Q29 +12V N007 N011 0 2N3904
R28 +12V N022 10K
R27 +12V N007 10K
D51 N007 NC_01 1N4148
D52 N007 QD_0 1N4148
D53 N022 QD_1 1N4148
D54 N022 NC_02 1N4148
R30 N012 0 10K
D50 N007 QD_2 1N4148
D55 N022 QD_0 1N4148
Q27 NQD_1 N032 0 0 2N3904
Q28 QD_1 N031 0 0 2N3904
D46 N032 N042 1N4148
D49 N031 N042 1N4148
D47 0 N032 1N4148
D48 0 N031 1N4148
R375 N031 NQD_1 100k
R381 QD_1 N032 99k
C29 N031 NQD_1 220p
C30 QD_1 N032 220p
R379 +12V NQD_1 10k
R380 +12V QD_1 10k
R377 +12V N042 100K
R378 N042 0 100K
C28 N042 N041 220p
R382 N041 N034 10K
Q3 NQD_2 N006 0 0 2N3904
Q4 QD_2 N005 0 0 2N3904
D58 N006 N020 1N4148
D61 N005 N020 1N4148
D59 0 N006 1N4148
D60 0 N005 1N4148
R99 N005 NQD_2 100k
R100 QD_2 N006 99k
C32 N005 NQD_2 220p
C33 QD_2 N006 220p
R97 +12V NQD_2 10k
R98 +12V QD_2 10k
R101 +12V N020 100K
R103 N020 0 100K
C31 N020 N019 220p
R102 N019 N018 10K
D45 N034 QD_0 1N4148
D44 N034 NQD_2 1N4148
R383 N034 +12V 10K
R1 +12V QC_3 500k
.model D D
.lib standard.dio
.model NPN NPN
.model PNP PNP
.lib standard.bjt
.tran 0.5 startup
* A
* B
* C
* D
* E
.backanno
.end